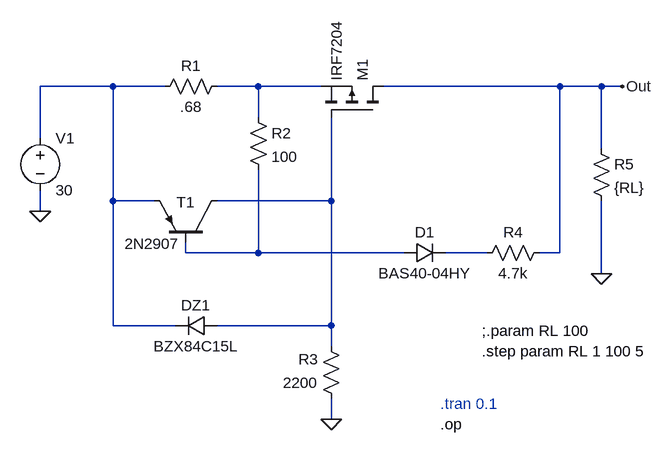
[diagram p0: schematic Foldback01.asc]
Foldback01.asc, the LTspice schematic file:
Version 4.1
SHEET 1 880 680
WIRE -112 112 -224 112
WIRE -32 112 -112 112
WIRE 112 112 48 112
WIRE 208 112 112 112
WIRE 576 112 304 112
WIRE 640 112 576 112
WIRE 672 112 640 112
WIRE 112 160 112 112
WIRE -224 192 -224 112
WIRE 640 208 640 112
WIRE -112 288 -112 112
WIRE -48 288 -112 288
WIRE 224 288 224 160
WIRE 224 288 48 288
WIRE -224 304 -224 272
WIRE 0 368 0 352
WIRE 112 368 112 240
WIRE 112 368 0 368
WIRE 336 368 112 368
WIRE 464 368 400 368
WIRE 576 368 576 112
WIRE 576 368 544 368
WIRE 640 400 640 288
WIRE -112 480 -112 288
WIRE -16 480 -112 480
WIRE 224 480 224 288
WIRE 224 480 48 480
WIRE 224 512 224 480
WIRE 224 624 224 592
FLAG -224 304 0
FLAG 224 624 0
FLAG 672 112 Out
FLAG 640 400 0
SYMBOL pmos 304 160 M270
SYMATTR InstName M1
SYMATTR Value IRF7204
SYMBOL res 64 96 R90
WINDOW 0 0 56 VBottom 2
WINDOW 3 32 56 VTop 2
SYMATTR InstName R1
SYMATTR Value .68
SYMBOL res 560 352 R90
WINDOW 0 0 56 VBottom 2
WINDOW 3 32 56 VTop 2
SYMATTR InstName R4
SYMATTR Value 4.7k
SYMBOL res 240 608 R180
WINDOW 0 36 76 Left 2
WINDOW 3 36 40 Left 2
SYMATTR InstName R3
SYMATTR Value 2200
SYMBOL diode 48 464 R90
WINDOW 0 0 32 VBottom 2
WINDOW 3 32 32 VTop 2
SYMATTR InstName DZ1
SYMATTR Value BZX84C15L
SYMBOL diode 336 384 R270
WINDOW 0 32 32 VTop 2
WINDOW 3 0 32 VBottom 2
SYMATTR InstName D1
SYMATTR Value BAS40-04HY
SYMBOL res 96 144 R0
SYMATTR InstName R2
SYMATTR Value 100
SYMBOL pnp 48 352 M270
WINDOW 0 62 62 VLeft 2
WINDOW 3 -2 142 VLeft 2
SYMATTR InstName T1
SYMATTR Value 2N2907
SYMBOL voltage -224 176 R0
WINDOW 123 0 0 Left 0
WINDOW 39 0 0 Left 0
SYMATTR InstName V1
SYMATTR Value 30
SYMBOL res 624 192 R0
SYMATTR InstName R5
SYMATTR Value {RL}
TEXT 456 488 Left 2 !;.param RL 100\n.step param RL 1 100 5
TEXT 392 600 Left 2 ;.tran 0.1
TEXT 392 632 Left 2 !.op

The netlist it stands for:
* Foldback01.asc
M1 Out N003 N002 N002 IRF7204
R1 N002 N001 .68
R4 Out N005 4.7k
R3 0 N003 2200
DZ1 N003 N001 BZX84C15L
D1 N004 N005 BAS40-04HY
R2 N002 N004 100
Q§T1 N003 N004 N001 0 2N2907
V1 N001 0 30
R5 Out 0 {RL}
.model D D
.lib standard.dio
.model NPN NPN
.model PNP PNP
.lib standard.bjt
.model NMOS NMOS
.model PMOS PMOS
.lib standard.mos
;.param RL 100
.step param RL 1 100 5
* .tran 0.1
.op
.backanno
.end